# Altium project ASK.PrjPcb
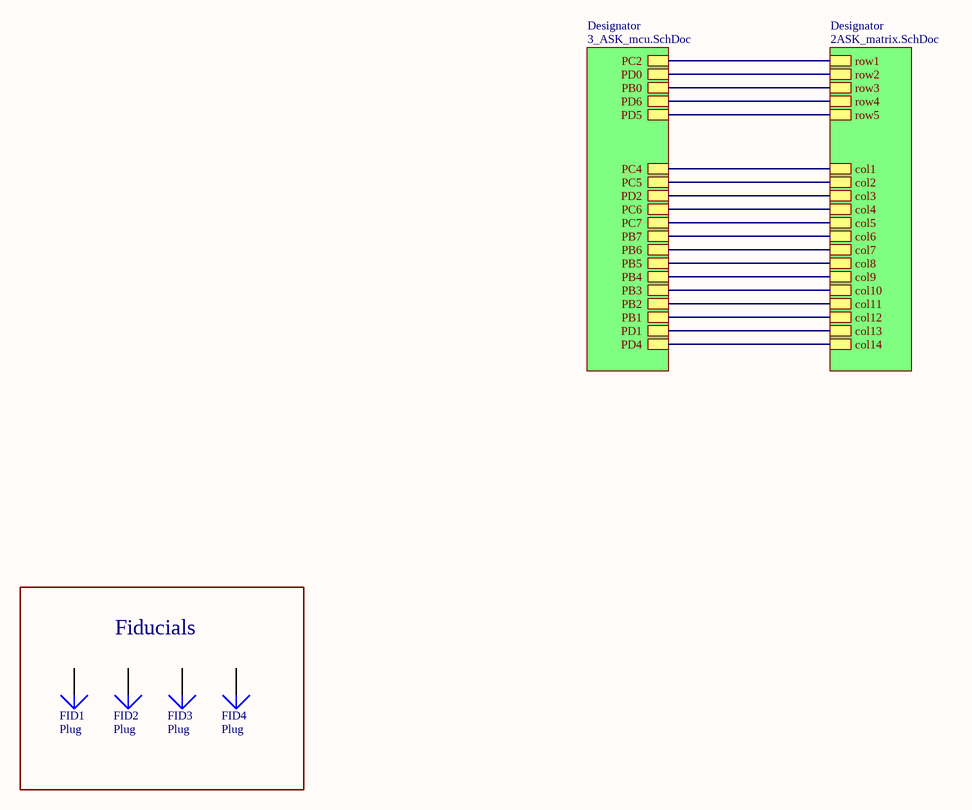
[diagram p0: 1_ASK_top.SchDoc]
ProjectTitle: Waffling60 - ALPS Solder; Revision: B5
1 sheet, 4 parts. Net scope: hierarchical (ports join the sheet entries above them; power ports are global).
Board file: ASK.PcbDoc

## Sheet 1_ASK_top.SchDoc: =ProjectTitle
size A4; Engineer: 4pplet; Address1: github.com/4pplet/waffling60; Address2: Licence: CERN-OHL-S; Revision: B5; SheetNumber: 1; SheetTotal: 3; ProjectName: waffling60

### Parts
FID1  Plug  [Fiducial_Nordic]  (no BOM)
FID2  Plug  [Fiducial_Nordic]  (no BOM)
FID3  Plug  [Fiducial_Nordic]  (no BOM)
FID4  Plug  [Fiducial_Nordic]  (no BOM)

### Blocks framed on the sheet
Fiducials: FID1-FID4

### Sub-sheets
Designator = 3_ASK_mcu.SchDoc (file not in this document): PD0, PD1, PC2, PD2, PD4, PC4, PD5, PB5, PB6, PB4, PB2, PD6, PB3, PB1, PB0, PC7, PB7, PC6, PC5
Designator = 2ASK_matrix.SchDoc (file not in this document): col6, col8, col5, col7, col3, col2, col1, col4, col9, row3, row1, row4, row2, row5, col11, col10, col14, col13, col12

### Nets
(unnamed): sheet Designator/PD0, sheet Designator/row2
(unnamed): sheet Designator/PD1, sheet Designator/col13
(unnamed): sheet Designator/PC2, sheet Designator/row1
(unnamed): sheet Designator/PD2, sheet Designator/col3
(unnamed): sheet Designator/PD4, sheet Designator/col14
(unnamed): sheet Designator/PC4, sheet Designator/col1
(unnamed): sheet Designator/PD5, sheet Designator/row5
(unnamed): sheet Designator/PB5, sheet Designator/col8
(unnamed): sheet Designator/PB6, sheet Designator/col7
(unnamed): sheet Designator/PB4, sheet Designator/col9
(unnamed): sheet Designator/PB2, sheet Designator/col11
(unnamed): sheet Designator/PD6, sheet Designator/row4
(unnamed): sheet Designator/PB3, sheet Designator/col10
(unnamed): sheet Designator/PB1, sheet Designator/col12
(unnamed): sheet Designator/PB0, sheet Designator/row3
(unnamed): sheet Designator/PC7, sheet Designator/col5
(unnamed): sheet Designator/PB7, sheet Designator/col6
(unnamed): sheet Designator/PC6, sheet Designator/col4
(unnamed): sheet Designator/PC5, sheet Designator/col2

Not connected (* = marked no-connect by the designer): FID1 1; FID2 1; FID3 1; FID4 1

### Notes on the sheet
- Title
- Size:
- Date:
- A4
- Number:
- Time:
- Revision:
- Sheet
- of
- File: